# Altium schematic sheet Miluino.SchDoc
size 420 x 297 mm; SPICEModelCacheTQTBMXIB: <root> / <DocumentId>TQTBMXIB</DocumentId> / </root>; Author: ALTIUM GOSTBOM2.0 KEV; SheetNumber: 1; SheetTotal: 3
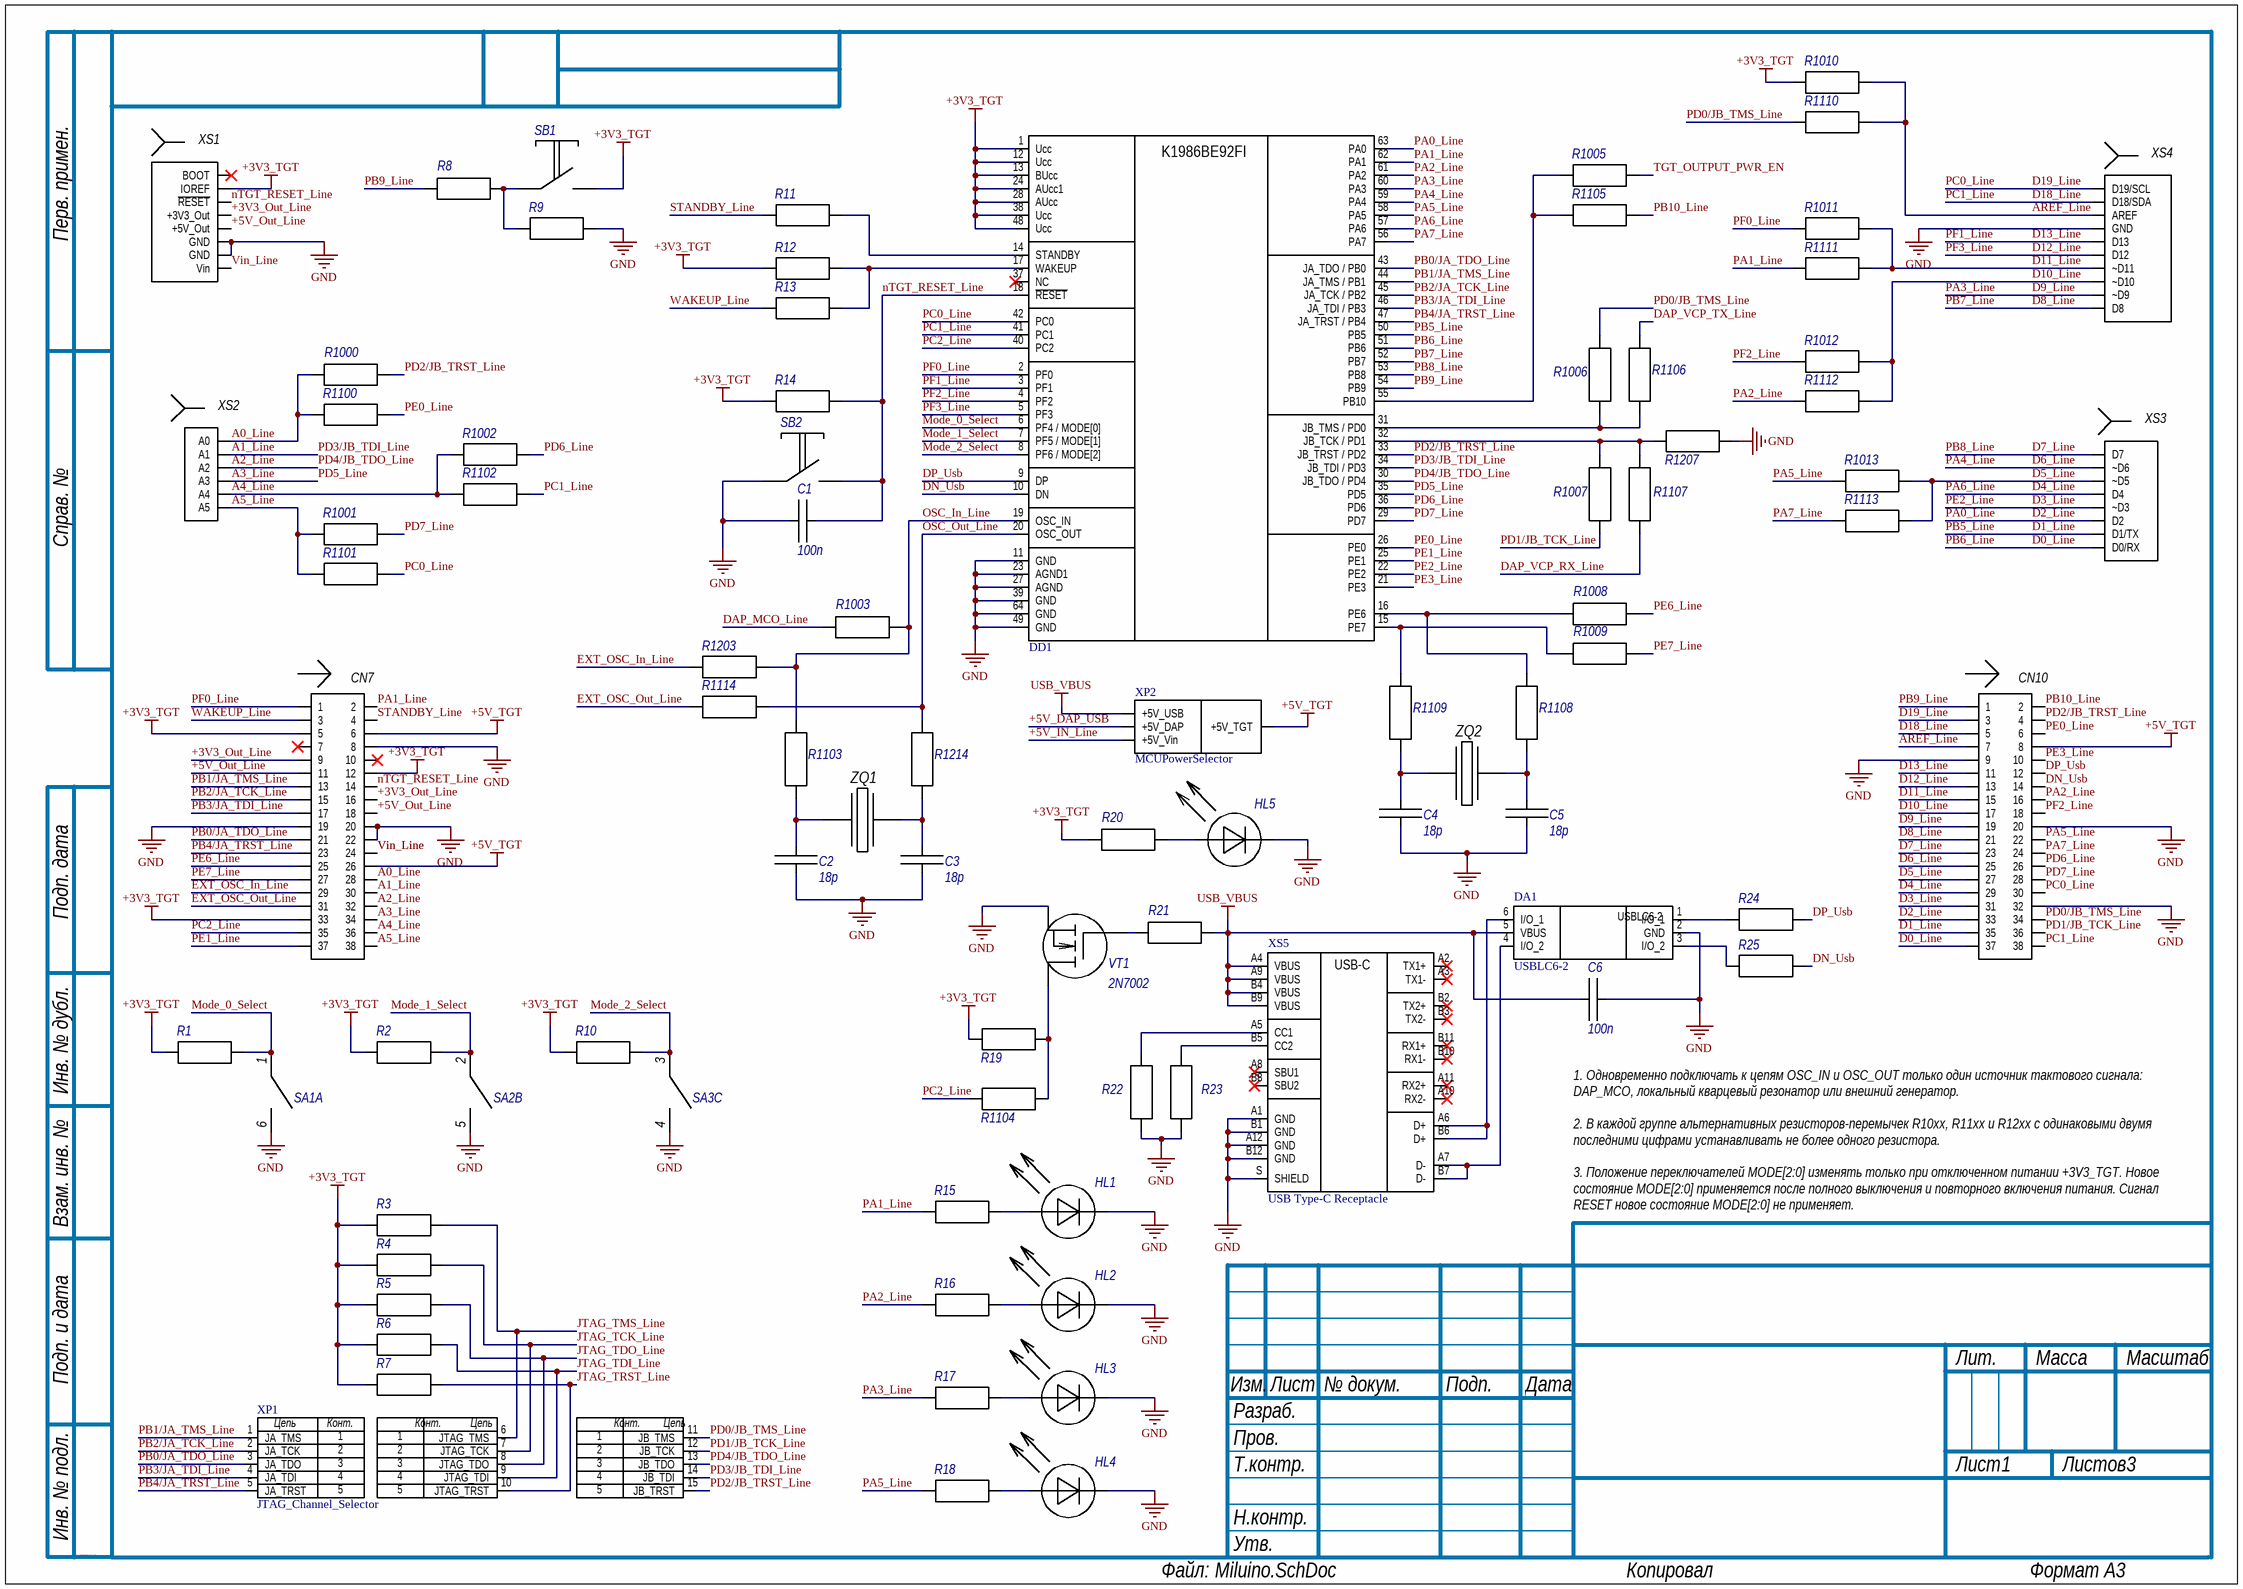
[diagram p0: Miluino.SchDoc]

## Parts
C1  100n
C2  18p
C3  18p
C4  18p
C5  18p
C6  100n
CN7  StMorpho  (value not drawn)
CN10  StMorpho  (value not drawn)
DA1  USBLC6-2
DD1  К1986ВЕ92FI  [К1986ВЕ92FI]  (value not drawn)
HL1  TBD  (value not drawn)
HL2  TBD  (value not drawn)
HL3  TBD  (value not drawn)
HL4  TBD  (value not drawn)
HL5  TBD  (value not drawn)
R1  TBD  (value not drawn)
R2  TBD  (value not drawn)
R3  100k  (value not drawn)
R4  100k  (value not drawn)
R5  100k  (value not drawn)
R6  100k  (value not drawn)
R7  100k  (value not drawn)
R8  0  (value not drawn)
R9  TBD  (value not drawn)
R10  TBD  (value not drawn)
R11  TBD  (value not drawn)
R12  100k  (value not drawn)
R13  0  (value not drawn)
R14  TBD  (value not drawn)
R15  TBD  (value not drawn)
R16  TBD  (value not drawn)
R17  TBD  (value not drawn)
R18  TBD  (value not drawn)
R19  10k  (value not drawn)
R20  TBD  (value not drawn)
R21  100k  (value not drawn)
R22  5,1k  (value not drawn)
R23  5,1k  (value not drawn)
R24  22  (value not drawn)
R25  22  (value not drawn)
R1000  0  (value not drawn)
R1001  0  (value not drawn)
R1002  0  (value not drawn)
R1003  0  (value not drawn)
R1005  0  (value not drawn)
R1006  0  (value not drawn)
R1007  0  (value not drawn)
R1008  0  (value not drawn)
R1009  0  (value not drawn)
R1010  0  (value not drawn)
R1011  0  (value not drawn)
R1012  0  (value not drawn)
R1013  0  (value not drawn)
R1100  0  (value not drawn)
R1101  0  (value not drawn)
R1102  0  (value not drawn)
R1103  0  (value not drawn)
R1104  0  (value not drawn)
R1105  0  (value not drawn)
R1106  0  (value not drawn)
R1107  0  (value not drawn)
R1108  0  (value not drawn)
R1109  0  (value not drawn)
R1110  0  (value not drawn)
R1111  0  (value not drawn)
R1112  0  (value not drawn)
R1113  0  (value not drawn)
R1114  0  (value not drawn)
R1203  0  (value not drawn)
R1207  0  (value not drawn)
R1214  0  (value not drawn)
SA1  Обозначение при заказе  (value not drawn)  (part A of 3)
SA2  Обозначение при заказе  (value not drawn)  (part B of 3)
SA3  Обозначение при заказе  (value not drawn)  (part C of 3)
SB1  TBD  (value not drawn)
SB2  TBD  (value not drawn)
VT1  2N7002
XP1  JTAG_Channel_Selector  [JTAG_Channel_Selector]
XP2  MCUPowerSelector  [PowerSelector]
XS1  ArduinoPowerHeader  (value not drawn)
XS2  ArduinoAnalogHeader  (value not drawn)
XS3  ArduinoDigital_1  (value not drawn)
XS4  ArduinoDigital_2  (value not drawn)
XS5  USB Type-C Receptacle  [TE USB-C 2129691-1]
ZQ1  Кварцевые резонаторы  [DSO-N4]  (value not drawn)
ZQ2  Кварцевые резонаторы  [DSO-N4]  (value not drawn)

## Nets
+3V3_TGT: CN7.5 CN7.12 CN7.33 DD1.1(Ucc) DD1.12(Ucc) DD1.13(BUcc) DD1.24(AUcc1) DD1.28(AUcc) DD1.38(Ucc) DD1.48(Ucc) R1.2 R2.2 R3.2 R4.2 R5.2 R6.2 R7.2 R10.2 R12.2 R14.2 R19.2 R20.1 R1010.2 SB1.2 XS1.2(IOREF)
+5V_TGT: CN7.6 CN7.26 CN10.8 XP2.1(+5V_TGT)
GND: C1.1 C2.2 C3.2 C4.2 C5.2 C6.2 CN7.8 CN7.19 CN7.20 CN7.22 CN10.9 CN10.20 CN10.32 DA1.2(GND) DD1.11(GND) DD1.23(AGND1) DD1.27(AGND) DD1.39(GND) DD1.49(GND) DD1.64(GND) HL1.2(C) HL2.2(C) HL3.2(C) HL4.2(C) HL5.2(C) R9.1 R22.2 R23.2 R1207.2 SA1.6 SA2.5 SA3.4 SB2.1 VT1.S XS1.6(GND) XS1.7(GND) XS4.7(GND) XS5.A1(GND) XS5.A12(GND) XS5.B1(GND) XS5.B12(GND) XS5.S(SHIELD)
USB_VBUS: C6.1 DA1.5(VBUS) R21.1 XP2.2(+5V_USB) XS5.A4(VBUS) XS5.A9(VBUS) XS5.B4(VBUS) XS5.B9(VBUS)
+3V3_Out_Line: CN7.9 CN7.16 XS1.4(+3V3_Out)
+5V_DAP_USB: XP2.3(+5V_DAP)
+5V_IN_Line: XP2.4(+5V_Vin)
+5V_Out_Line: CN7.11 CN7.18 XS1.5(+5V_Out)
A0_Line: CN7.28 R1000.2 R1100.2 XS2.1(A0)
A1_Line: CN7.30 DD1.34(JB_TDI_/_PD3) XP1.14(JB_TDI) XS2.2(A1)  [also labelled PD3/JB_TDI_Line]
A2_Line: CN7.32 DD1.30(JB_TDO_/_PD4) XP1.13(JB_TDO) XS2.3(A2)  [also labelled PD4/JB_TDO_Line]
A3_Line: CN7.34 DD1.35(PD5) XS2.4(A3)  [also labelled PD5_Line]
A4_Line: CN7.36 R1002.2 R1102.2 XS2.5(A4)
A5_Line: CN7.38 R1001.2 R1101.2 XS2.6(A5)
AREF_Line: CN10.7 R1010.1 R1110.1 XS4.8(AREF)
D0_Line: CN10.37 DD1.51(PB6) XS3.1(D0/RX)  [also labelled PB6_Line]
D1_Line: CN10.35 DD1.50(PB5) XS3.2(D1/TX)  [also labelled PB5_Line]
D2_Line: CN10.33 DD1.63(PA0) XS3.3(D2)  [also labelled PA0_Line]
D3_Line: CN10.31 DD1.22(PE2) XS3.4(~D3)  [also labelled PE2_Line]
D4_Line: CN10.29 DD1.57(PA6) XS3.5(D4)  [also labelled PA6_Line]
D5_Line: CN10.27 R1013.1 R1113.1 XS3.6(~D5)
D6_Line: CN10.25 DD1.59(PA4) XS3.7(~D6)  [also labelled PA4_Line]
D7_Line: CN10.23 DD1.53(PB8) XS3.8(D7)  [also labelled PB8_Line]
D8_Line: CN10.21 DD1.52(PB7) XS4.1(D8)  [also labelled PB7_Line]
D9_Line: CN10.19 DD1.60(PA3) R17.2 XS4.2(~D9)  [also labelled PA3_Line]
D10_Line: CN10.17 R1012.1 R1112.1 XS4.3(~D10)
D11_Line: CN10.15 R1011.1 R1111.1 XS4.4(~D11)
D12_Line: CN10.13 DD1.5(PF3) XS4.5(D12)  [also labelled PF3_Line]
D13_Line: CN10.11 DD1.3(PF1) XS4.6(D13)  [also labelled PF1_Line]
D18_Line: CN10.5 CN10.38 DD1.41(PC1) R1102.1 XS4.9(D18/SDA)  [also labelled PC1_Line]
D19_Line: CN10.3 CN10.30 DD1.42(PC0) R1101.1 XS4.10(D19/SCL)  [also labelled PC0_Line]
DAP_MCO_Line: R1003.1
DAP_VCP_RX_Line: R1107.1
DAP_VCP_TX_Line: R1106.1
DN_Usb: CN10.14 DD1.10(DN) R25.1
DP_Usb: CN10.12 DD1.9(DP) R24.1
EXT_OSC_In_Line: CN7.29 R1203.2
EXT_OSC_Out_Line: CN7.31 R1114.2
JTAG_TCK_Line: R4.1 XP1.7(JTAG_TCK)
JTAG_TDI_Line: R6.1 XP1.9(JTAG_TDI)
JTAG_TDO_Line: R5.1 XP1.8(JTAG_TDO)
JTAG_TMS_Line: R3.1 XP1.6(JTAG_TMS)
JTAG_TRST_Line: R7.1 XP1.10(JTAG_TRST)
Mode_0_Select: DD1.6(PF4_/_MODE[0]) R1.1 SA1.1
Mode_1_Select: DD1.7(PF5_/_MODE[1]) R2.1 SA2.2
Mode_2_Select: DD1.8(PF6_/_MODE[2]) R10.1 SA3.3
nTGT_RESET_Line: C1.2 CN7.14 DD1.18(~{RESET}) R14.1 SB2.2 XS1.3(~{RESET})
OSC_In_Line: DD1.19(OSC_IN) R1003.2 R1103.1 R1203.1
OSC_Out_Line: DD1.20(OSC_OUT) R1114.1 R1214.1
PA1_Line: CN7.2 DD1.62(PA1) R15.2 R1111.2
PA2_Line: CN10.16 DD1.61(PA2) R16.2 R1112.2
PA5_Line: CN10.22 DD1.58(PA5) R18.2 R1013.2
PA7_Line: CN10.24 DD1.56(PA7) R1113.2
PB0/JA_TDO_Line: CN7.21 DD1.43(JA_TDO_/_PB0) XP1.3(JA_TDO)
PB1/JA_TMS_Line: CN7.13 DD1.44(JA_TMS_/_PB1) XP1.1(JA_TMS)
PB2/JA_TCK_Line: CN7.15 DD1.45(JA_TCK_/_PB2) XP1.2(JA_TCK)
PB3/JA_TDI_Line: CN7.17 DD1.46(JA_TDI_/_PB3) XP1.4(JA_TDI)
PB4/JA_TRST_Line: CN7.23 DD1.47(JA_TRST_/_PB4) XP1.5(JA_TRST)
PB9_Line: CN10.1 DD1.54(PB9) R8.1
PB10_Line: CN10.2 R1105.1
PC2_Line: CN7.35 DD1.40(PC2) R1104.2
PD0/JB_TMS_Line: CN10.34 R1006.1 R1110.2 XP1.11(JB_TMS)
PD1/JB_TCK_Line: CN10.36 R1007.1 XP1.12(JB_TCK)
PD2/JB_TRST_Line: CN10.4 DD1.33(JB_TRST_/_PD2) R1000.1 XP1.15(JB_TRST)
PD6_Line: CN10.26 DD1.36(PD6) R1002.1
PD7_Line: CN10.28 DD1.29(PD7) R1001.1
PE0_Line: CN10.6 DD1.26(PE0) R1100.1
PE1_Line: CN7.37 DD1.25(PE1)
PE3_Line: CN10.10 DD1.21(PE3)
PE6_Line: CN7.25 R1008.1
PE7_Line: CN7.27 R1009.1
PF0_Line: CN7.1 DD1.2(PF0) R1011.2
PF2_Line: CN10.18 DD1.4(PF2) R1012.2
STANDBY_Line: CN7.4 R11.2
TGT_OUTPUT_PWR_EN: R1005.1
Vin_Line: CN7.24 XS1.8(Vin)
WAKEUP_Line: CN7.3 R13.2
NetC2_1: C2.1 R1103.2 ZQ1.1
NetC3_1: C3.1 R1214.2 ZQ1.3
NetC4_1: C4.1 R1109.2 ZQ2.1
NetC5_1: C5.1 R1108.2 ZQ2.3
NetDA1_1: DA1.1(I/O_1) R24.2
NetDA1_3: DA1.3(I/O_2) R25.2
NetDA1_4: DA1.4(I/O_2) XS5.A7(D-) XS5.B7(D-)
NetDA1_6: DA1.6(I/O_1) XS5.A6(D+) XS5.B6(D+)
NetDD1_14: DD1.14(STANDBY) R11.1
NetDD1_15: DD1.15(PE7) R1009.2 R1109.1
NetDD1_16: DD1.16(PE6) R1008.2 R1108.1
NetDD1_17: DD1.17(WAKEUP) R12.1 R13.1
NetDD1_31: DD1.31(JB_TMS_/_PD0) R1006.2 R1106.2
NetDD1_32: DD1.32(JB_TCK_/_PD1) R1007.2 R1107.2 R1207.1
NetDD1_55: DD1.55(PB10) R1005.2 R1105.2
NetHL1_1: HL1.1(A) R15.1
NetHL2_1: HL2.1(A) R16.1
NetHL3_1: HL3.1(A) R17.1
NetHL4_1: HL4.1(A) R18.1
NetHL5_1: HL5.1(A) R20.2
NetR8_2: R8.2 R9.2 SB1.1
NetR19_1: R19.1 R1104.1 VT1.D
NetR21_2: R21.2 VT1.G
NetR22_1: R22.1 XS5.A5(CC1)
NetR23_1: R23.1 XS5.B5(CC2)

Not connected (* = marked no-connect by the designer): CN7 7* 10*; DD1 37(NC)*; XS1 1(BOOT)*; XS5 A2(TX1+)* A3(TX1-)* A8(SBU1)* A10(RX2-)* A11(RX2+)* B2(TX2+)* B3(TX2-)* B8(SBU2)* B10(RX1-)* B11(RX1+)*

## Notes on the sheet
- (near XS1) XS1
- (near XS4) XS4
- (near XS2) XS2
- (near XS3) XS3
- (near CN7) CN7
- (near CN10) CN10
- 1. Одновременно подключать к цепям OSC_IN и OSC_OUT только один источник тактового сигнала: DAP_MCO, локальный кварцевый резонатор или внешний генератор.
  2. В каждой группе альтернативных резисторов-перемычек R10xx, R11xx и R12xx с одинаковыми двумя последними цифрами устанавливать не более одного резистора.
  3. Положение переключателей MODE[2:0] изменять только при отключенном питании +3V3_TGT. Новое состояние MODE[2:0] применяется после полного выключения и повторного включения питания. Сигнал RESET новое состояние MODE[2:0] не применяет.
- Перв. примен.
- Справ. №
- Подп. дата
- Инв. № дубл.
- Взам. инв. №
- Подп. и дата
- Изм.
- Разраб.
- Лист
- № докум.
- Подп.
- Дата
- Лит.
- Масса
- Масштаб
- Пров.
- Т.контр.
- Листов
- Инв. № подл.
- Н.контр.
- Утв.
- ALTIUM GOSTBOM2.0 KEV
- Файл:
- Копировал
- Формат А3
- (in symbol JTAG_Channel_Selector) Цепь; Конт.
- (in symbol USB Type-C Receptacle) USB-C
- (in symbol К1986ВЕ92FI) K1986BE92FI

## Library data of the parts
C1 = Cap: K1986VE92FI TARGET_nRESET noise-filter capacitor to GND, 100nF, X7R
C2 = Cap: Optional K1986 HSE OSC_IN crystal load capacitor, 18pF provisional, C0G/NP0, DNP by default
C3 = Cap: Optional K1986 HSE OSC_OUT crystal load capacitor, 18pF provisional, C0G/NP0, DNP by default
C4 = Cap: Optional K1986 LSE OSC32_OUT crystal load capacitor, 18pF provisional, C0G/NP0, DNP by default
C5 = Cap: Optional K1986 LSE OSC32_IN crystal load capacitor, 18pF provisional, C0G/NP0, DNP by default
C6 = Cap: Target USB connector VBUS bypass capacitor near ESD protection, value 100n
DA1 = USBLC6-2: USBLC6-2SC6 low-capacitance ESD protection for target USB D+ and D-
DD1 = К1986ВЕ92FI: 32-bit MCU, Milandr, 64-pin package FI
HL1 = LED: USER_LED1 indicator driven by K1986 PA1 through R15, color and part TBD
HL2 = LED: USER_LED2 indicator driven by K1986 PA2 through R16, color and part TBD
HL3 = LED: USER_LED3 indicator driven by K1986 PA3 through R17, color and part TBD
HL4 = LED: USER_LED4 indicator driven by K1986 PA5 through R18, color and part TBD
HL5 = LED: +3V3_TGT power indicator LED; color and part TBD
R1 = res: MODE0 local selector pull-up to +3V3_TGT; final value TBD
R2 = res: MODE1 local selector pull-up to +3V3_TGT; final value TBD
R3-R7 = res: K1986 JTAG common signal pull-up to +3V3_TGT, 100k; maintains defined level when selectors are open
R8 = res: Default 0 ohm link connecting K1986 PB9 to USER_BUTTON and its pull-down
R9 = res: USER_BUTTON pull-down from PB9 button node to GND; final value TBD
R10 = res: MODE2 local selector pull-up to +3V3_TGT; final value TBD
R11 = res: K1986 STANDBY output series resistor to Morpho CN7.4, nominal 1k pending approval
R12 = res: K1986 WAKEUP pull-up to +3V3_TGT, 100k
R13 = res: Optional 0 ohm WAKEUP link from Morpho CN7.3 to K1986 WAKEUP, DNP by default
R14 = res: K1986 TARGET_nRESET pull-up to +3V3_TGT; final value TBD
R15 = res: USER_LED1 series current-limiting resistor from PA1, target range 2.2k to 4.7k, final value TBD
R16 = res: USER_LED2 series current-limiting resistor from PA2, target range 2.2k to 4.7k, final value TBD
R17 = res: USER_LED3 series current-limiting resistor from PA3, target range 2.2k to 4.7k, final value TBD
R18 = res: USER_LED4 series current-limiting resistor from PA5, target range 2.2k to 4.7k, final value TBD
R19 = res: Target USB VBUS detector drain pull-up to +3V3_TGT, 10k; fitted by default
R20 = res: +3V3_TGT power indicator LED series resistor, value TBD
R21 = res: Target USB VBUS detector gate pull-down to GND, 100k; connection pending correction
R22 = res: Target USB Type-C Device/UFP CC2 Rd pull-down resistor to GND, 5.1k, 1%
R23 = res: Target USB Type-C Device/UFP CC1 Rd pull-down resistor to GND, 5.1k, 1%
R24 = res: Target USB D+ series damping resistor, 22 ohm provisional
R25 = res: Target USB D- series damping resistor, 22 ohm provisional
R1000 = res: Default 0 ohm Arduino A0 to K1986 PD2/ADC2 link
R1001 = res: Default 0 ohm Arduino A5 to K1986 PD7/ADC7 link
R1002 = res: Default 0 ohm Arduino A4 to K1986 PD6/ADC6 link
R1003 = res: Default 0 ohm DAP_MCO_Line to K1986 OSC_IN clock link
R1005 = res: Default 0 ohm K1986 PB10 to  TGT_OUTPUT_PWR_EN line
R1006 = res: Default 0 ohm K1986 PD0/UART2_RXD to Morpho and JTAG_B link
R1007 = res: Default 0 ohm K1986 PD1/UART2_TXD to Morpho and JTAG_B link
R1008 = res: Default 0 ohm K1986 PE6 to Morpho CN7.25 link
R1009 = res: Default 0 ohm K1986 PE7 to Morpho CN7.27 link
R1010 = res: Default 0 ohm +3V3_TGT to Arduino AREF link; external AREF drive prohibited while fitted
R1011 = res: Default 0 ohm K1986 PF0/SSP1_TXD to Arduino D11 MOSI link
R1012 = res: Default 0 ohm K1986 PF2/SSP1_FSS to Arduino D10 link
R1013 = res: Default 0 ohm K1986 PA5/TMR1_CH3 to Arduino D5 PWM link
R1100 = res: Optional 0 ohm Arduino A0 to K1986 PE0/DAC2_OUT link, DNP by default
R1101 = res: Optional 0 ohm Arduino A5 to K1986 PC0/SCL1 link, DNP by default
R1102 = res: Optional 0 ohm Arduino A4 to K1986 PC1/SDA1 link, DNP by default
R1103 = res: Optional 0 ohm link from local HSE crystal to K1986 OSC_IN, DNP by default
R1104 = res: Optional 0 ohm link from USB VBUS detector drain to K1986 PC2/CN7.35; DNP by default
R1105 = res: Optional 0 ohm K1986 PB10 to PB10_Line, DNP by default
R1106 = res: Optional 0 ohm DAP_VCP_TX to K1986 PD0/UART2_RXD link, DNP by default
R1107 = res: Optional 0 ohm K1986 PD1/UART2_TXD to DAP_VCP_RX link, DNP by default
R1108 = res: Optional 0 ohm link from K1986 PE6/OSC32_IN to local LSE crystal, DNP by default
R1109 = res: Optional 0 ohm link from K1986 PE7/OSC32_OUT to local LSE crystal, DNP by default
R1110 = res: Optional 0 ohm PD0/JB_TMS_Line to Arduino AREF link, DNP; external reference mode deferred
R1111 = res: Optional 0 ohm K1986 PA1/TMR1_CH1 to Arduino D11 PWM link, DNP by default
R1112 = res: Optional 0 ohm K1986 PA2/TMR1_CH1N to Arduino D10 PWM link, DNP by default
R1113 = res: Optional 0 ohm K1986 PA7/CAN1_RX to Arduino D5 link, DNP by default
R1114 = res: Optional 0 ohm K1986 OSC_OUT to Morpho EXT_OSC_Out_Line link, DNP by default
R1203 = res: Optional 0 ohm Morpho EXT_OSC_In_Line to K1986 OSC_IN link, DNP by default
R1207 = res: Optional 0 ohm link from K1986 PD1/ADC1_REF- to GND, DNP by default
R1214 = res: Optional 0 ohm link from local HSE crystal to K1986 OSC_OUT, DNP by default
SA1 = SWD1-3: Local mechanical selector for K1986 MODE0 bit; pull-up gives logic high and switch to GND gives logic low, part TBD
SA2 = SWD1-3: Local mechanical selector for K1986 MODE1 bit; pull-up gives logic high and switch to GND gives logic low, part TBD
SA3 = SWD1-3: Local mechanical selector for K1986 MODE2 bit; pull-up gives logic high and switch to GND gives logic low, part TBD
SB1 = SW-PB: USER_BUTTON normally open pushbutton from PB9 button node to +3V3_TGT; part TBD
SB2 = SW-PB: TARGET_nRESET normally open pushbutton to GND, part TBD
VT1 = TRANS-N-FET: Target USB VBUS detector for K1986 PC2; active-low output; gate wiring pending correction
XP1 = JTAG_Channel_Selector: Five-channel JTAG_A/OFF/JTAG_B route selector for local K1986 debug connector
XP2 = MCUPowerSelector: Three-source T-selector choosing DAP USB, target USB or Vin buck 5V for +5V_TGT
XS5 = USB Type-C Receptacle: Target USB Type-C receptacle, fixed Device/UFP/Sink; USB_VBUS input and shield tied to GND
ZQ1 = Кварцевые резонаторы: Optional local K1986 HSE crystal for OSC_IN and OSC_OUT, DNP by default; frequency and part TBD; Alternating Manufacture: АО "Завод "Метеор"; Product Code: 63 2100; Model: SMD07050C4; TU/GOST: фирма EPSON; Value: 32768 Hz; Component Name: MC-206 32,768 кГц; Published: 24.05.2021; Publisher: АО "НПО КАДЕТЕК"; Distributer: АО "Чип и Дип"; Category: Кварцевые резонаторы; Type: SMD07050C4
ZQ2 = Кварцевые резонаторы: Optional K1986 LSE crystal for PE6/OSC32_IN and PE7/OSC32_OUT, 32.768kHz, DNP by default; part TBD; Alternating Manufacture: АО "Завод "Метеор"; Product Code: 63 2100; Model: SMD07050C4; TU/GOST: фирма EPSON; Value: 32768 Hz; Component Name: MC-206 32,768 кГц; Published: 24.05.2021; Publisher: АО "НПО КАДЕТЕК"; Distributer: АО "Чип и Дип"; Category: Кварцевые резонаторы; Type: SMD07050C4